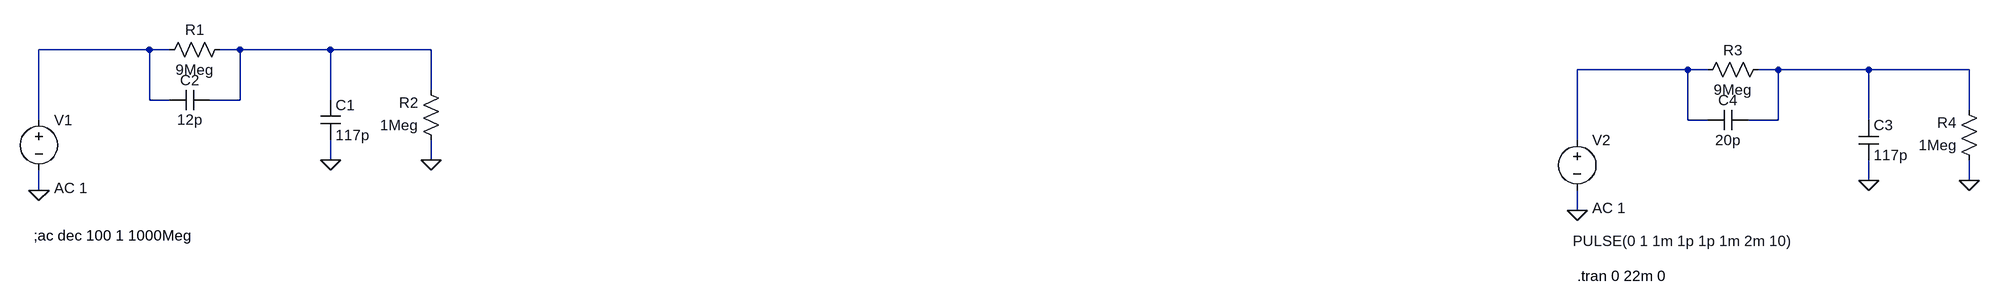
[diagram p0: schematic punta_de_prueba.asc]
punta_de_prueba.asc, the LTspice schematic file:
Version 4
SHEET 1 1588 680
WIRE -3856 -672 -4032 -672
WIRE -3824 -672 -3856 -672
WIRE -3712 -672 -3744 -672
WIRE -3568 -672 -3712 -672
WIRE -3408 -672 -3568 -672
WIRE -1408 -640 -1584 -640
WIRE -1376 -640 -1408 -640
WIRE -1264 -640 -1296 -640
WIRE -1120 -640 -1264 -640
WIRE -960 -640 -1120 -640
WIRE -3408 -608 -3408 -672
WIRE -3856 -592 -3856 -672
WIRE -3824 -592 -3856 -592
WIRE -3712 -592 -3712 -672
WIRE -3712 -592 -3760 -592
WIRE -3568 -592 -3568 -672
WIRE -960 -576 -960 -640
WIRE -4032 -560 -4032 -672
WIRE -1408 -560 -1408 -640
WIRE -1376 -560 -1408 -560
WIRE -1264 -560 -1264 -640
WIRE -1264 -560 -1312 -560
WIRE -1120 -560 -1120 -640
WIRE -1584 -528 -1584 -640
WIRE -3568 -496 -3568 -528
WIRE -3408 -496 -3408 -528
WIRE -1120 -464 -1120 -496
WIRE -960 -464 -960 -496
WIRE -4032 -448 -4032 -480
WIRE -1584 -416 -1584 -448
FLAG -4032 -448 0
FLAG -3568 -496 0
FLAG -3408 -496 0
FLAG -1584 -416 0
FLAG -1120 -464 0
FLAG -960 -464 0
SYMBOL res -3728 -688 R90
WINDOW 0 0 56 VBottom 2
WINDOW 3 32 56 VTop 2
SYMATTR InstName R1
SYMATTR Value 9Meg
SYMBOL res -3392 -512 R180
WINDOW 0 36 76 Left 2
WINDOW 3 36 40 Left 2
SYMATTR InstName R2
SYMATTR Value 1Meg
SYMBOL cap -3584 -592 R0
SYMATTR InstName C1
SYMATTR Value 117p
SYMBOL cap -3760 -608 R90
WINDOW 0 0 32 VBottom 2
WINDOW 3 32 32 VTop 2
SYMATTR InstName C2
SYMATTR Value 12p
SYMBOL voltage -4032 -576 R0
WINDOW 123 24 124 Left 2
WINDOW 39 0 0 Left 2
SYMATTR Value2 AC 1
SYMATTR InstName V1
SYMATTR Value ""
SYMBOL res -1280 -656 R90
WINDOW 0 0 56 VBottom 2
WINDOW 3 32 56 VTop 2
SYMATTR InstName R3
SYMATTR Value 9Meg
SYMBOL res -944 -480 R180
WINDOW 0 36 76 Left 2
WINDOW 3 36 40 Left 2
SYMATTR InstName R4
SYMATTR Value 1Meg
SYMBOL cap -1136 -560 R0
SYMATTR InstName C3
SYMATTR Value 117p
SYMBOL cap -1312 -576 R90
WINDOW 0 0 32 VBottom 2
WINDOW 3 32 32 VTop 2
SYMATTR InstName C4
SYMATTR Value 20p
SYMBOL voltage -1584 -544 R0
WINDOW 3 -7 177 Left 2
WINDOW 123 24 124 Left 2
WINDOW 39 0 0 Left 2
SYMATTR Value PULSE(0 1 1m 1p 1p 1m 2m 10)
SYMATTR Value2 AC 1
SYMATTR InstName V2
TEXT -4040 -376 Left 2 !;ac dec 100 1 1000Meg
TEXT -1584 -312 Left 2 !.tran 0 22m 0

The netlist it stands for:
* punta_de_prueba.asc
R1 N002 N001 9Meg
R2 0 N002 1Meg
C1 N002 0 117p
C2 N002 N001 12p
V1 N001 0 AC 1
R3 N004 N003 9Meg
R4 0 N004 1Meg
C3 N004 0 117p
C4 N004 N003 20p
V2 N003 0 PULSE(0 1 1m 1p 1p 1m 2m 10) AC 1
;ac dec 100 1 1000Meg
.tran 0 22m 0
.backanno
.end